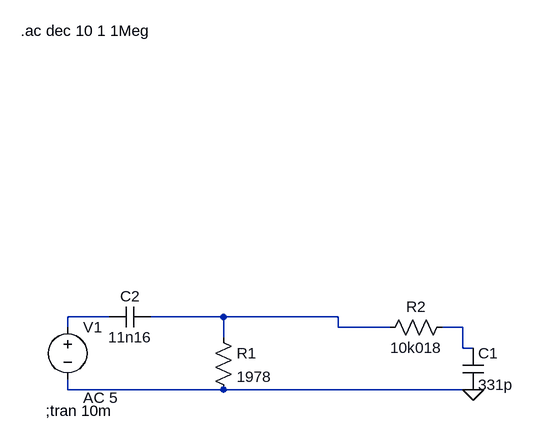
[diagram p0: schematic E7.asc]
E7.asc, the LTspice schematic file:
Version 4
SHEET 1 880 680
WIRE -16 112 -80 112
WIRE 160 112 48 112
WIRE 336 112 160 112
WIRE -80 128 -80 112
WIRE 336 128 336 112
WIRE 416 128 336 128
WIRE 528 128 496 128
WIRE 160 144 160 112
WIRE 528 160 528 128
WIRE 544 160 528 160
WIRE -80 224 -80 208
WIRE 160 224 -80 224
WIRE 544 224 160 224
FLAG 544 224 0
SYMBOL res 144 128 R0
SYMATTR InstName R1
SYMATTR Value 1978
SYMBOL res 512 112 R90
WINDOW 0 0 56 VBottom 2
WINDOW 3 32 56 VTop 2
SYMATTR InstName R2
SYMATTR Value 10k018
SYMBOL cap 528 160 R0
SYMATTR InstName C1
SYMATTR Value 331p
SYMBOL cap 48 96 R90
WINDOW 0 0 32 VBottom 2
WINDOW 3 32 32 VTop 2
SYMATTR InstName C2
SYMATTR Value 11n16
SYMBOL voltage -80 112 R0
WINDOW 123 24 124 Left 2
WINDOW 39 0 0 Left 2
SYMATTR InstName V1
SYMATTR Value ""
SYMATTR Value2 AC 5
TEXT -114 256 Left 2 !;tran 10m
TEXT -152 -328 Left 2 !.ac dec 10 1 1Meg

The netlist it stands for:
* E7.asc
R1 N002 0 1978
R2 N003 N002 10k018
C1 N003 0 331p
C2 N002 N001 11n16
V1 N001 0 AC 5
;tran 10m
.ac dec 10 1 1Meg
.backanno
.end